# EAGLE design current sense (EAGLE 9.2.2)
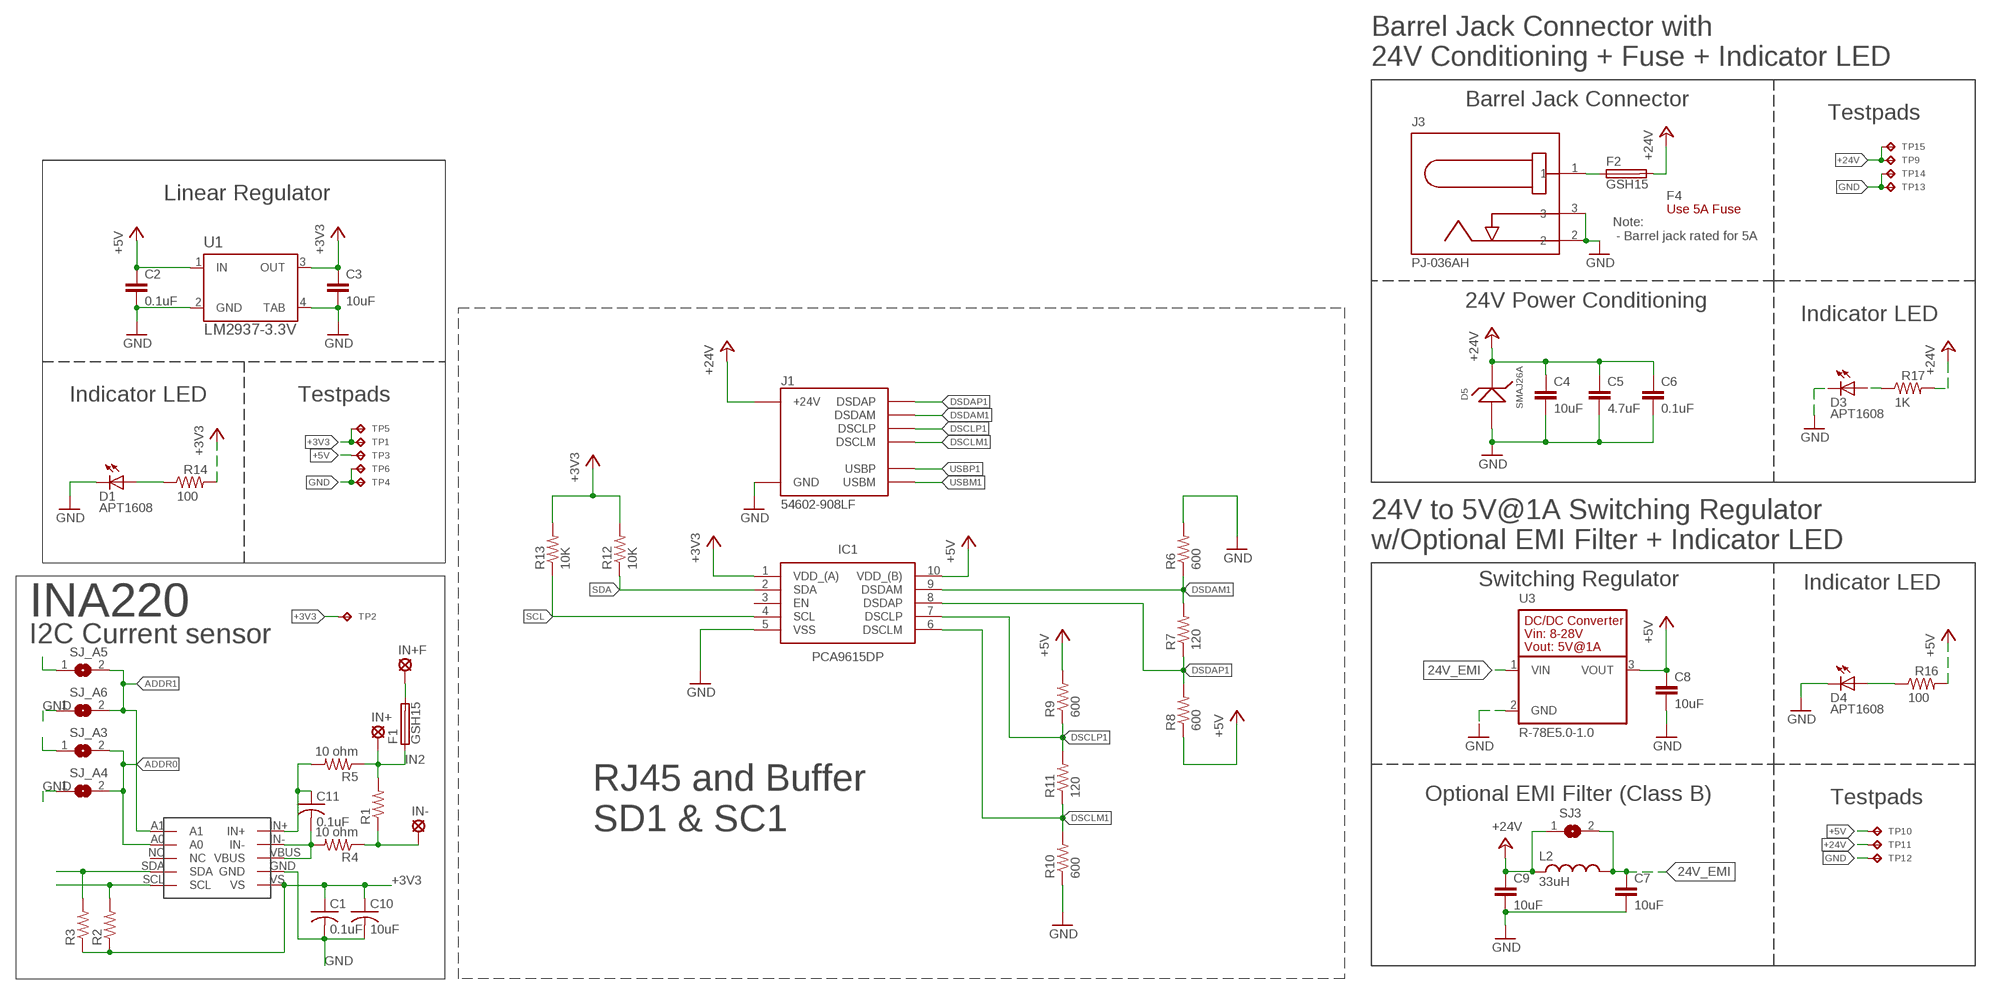
[diagram p0: schematic, sheet 1]

## Parts
C1  0.1uF  C-USC0603  [C0603]
C2  0.1uF  0.1UF-C0603C104K5RACTU  [C0603]
C3  10uF  10UF-GMK212BBJ106KG-T  [C0805]
C4  10uF  10UF-GMK212BBJ106KG-T  [C0805]
C5  4.7uF  4.7UF-CL21A475KBQNNNE  [C0805]
C6  0.1uF  0.1UF-C0603C104K5RACTU  [C0603]
C7  10uF  10UF-GMK212BBJ106KG-T  [C0805]
C8  10uF  10UF-GMK212BBJ106KG-T  [C0805]
C9  10uF  10UF-GMK212BBJ106KG-T  [C0805]
C10  10uF  C-USC0603  [C0603]
C11  0.1uF  C-USC0603  [C0603]
D1  APT1608  APT1608CGCK  [CHIPLED_0603]
D3  APT1608  APT1608CGCK  [CHIPLED_0603]
D4  APT1608  APT1608CGCK  [CHIPLED_0603]
D5  SMAJ26A  SMAJ26A-13-F  [SMA]
F1  GSH15  [GSH15]
F2  GSH15  [GSH15]
F4  Use 5A Fuse  0217005.MXP  [FUSE-CARTRIDGE]
IC1  PCA9615DP  [SOP50P490X110-10N]
IN+  LSP11  [LSP11]
IN+F  LSP11  [LSP11]
IN-  LSP11  [LSP11]
J1  54602-908LF  OPENAG-V1-RJ45PTH  [OPENAG-V1-RJ45]
J3  PJ-036AH  BARREL-JACK-PJ-036AH-SMT-TR  [BARREL-JACK-PJ-036AH]
L2  33uH  33UH-29333C  [29333C]
R1  R-US_R0805  [R0805]
R2  R-US_R0603  [R0603]
R3  R-US_R0603  [R0603]
R4  10 ohm  R-US_R0603  [R0603]
R5  10 ohm  R-US_R0603  [R0603]
R6  600  R-US_R0603  [R0603]
R7  120  R-US_R0603  [R0603]
R8  600  R-US_R0603  [R0603]
R9  600  R-US_R0603  [R0603]
R10  600  R-US_R0603  [R0603]
R11  120  R-US_R0603  [R0603]
R12  10K  R-US_R0603  [R0603]
R13  10K  R-US_R0603  [R0603]
R14  100  100OHM-RC0603JR-07100RL  [RC0603N]
R16  100  100OHM-RC0603JR-07100RL  [RC0603N]
R17  1K  1K-ERJ-PB3D1001V  [RC0603N]
SJ3  EMI-BYPASS  [EMI-BYPASS]
SJ_A3  SOLDERJUMPERREFLOW_NOPASTE  [SJ1]
SJ_A4  SOLDERJUMPERREFLOW_NOPASTE  [SJ1]
SJ_A5  SOLDERJUMPERREFLOW_NOPASTE  [SJ1]
SJ_A6  SOLDERJUMPERREFLOW_NOPASTE  [SJ1]
TP1  TPTP04R  [TP04R]
TP2  TPTP04R  [TP04R]
TP3  TPTP04R  [TP04R]
TP4  TPTP04R  [TP04R]
TP5  TPTP04R  [TP04R]
TP6  TPTP04R  [TP04R]
TP9  TPTP04R  [TP04R]
TP10  TPTP06R  [TP06R]
TP11  TPTP06R  [TP06R]
TP12  TPTP06R  [TP06R]
TP13  TPTP04R  [TP04R]
TP14  TPTP04R  [TP04R]
TP15  TPTP04R  [TP04R]
U1  LM2937-3.3V  LM2937IMP-3.3/NOPB  [MP04A]
U3  R-78E5.0-1.0  [R-78E5.0-1.0]
U$1  INA220  [VSSOP10]

## Nets
24V_EMI: C7.1 L2.2 SJ3.2 U3.1(VIN)
24V_IN1: F2.1 J3.1
+3V3: C1.1 C3.1 C10.1 IC1.1(VDD_(A)) R2.1 R3.1 R12.2 R13.2 R14.2 SJ_A3.1 SJ_A5.1 TP1.1(TP) TP2.1(TP) TP5.1(TP) U1.3(OUT) U$1.VS
+5V: C2.1 C8.1 IC1.10(VDD_(B)) R8.1 R9.2 R16.2 TP3.1(TP) TP10.TP U1.1(IN) U3.3(VOUT)
+24V: C4.1 C5.1 C6.1 C9.1 D5.1 F2.2 J1.24V(6)(+24V) L2.1 R17.2 SJ3.1 TP9.1(TP) TP11.TP TP15.1(TP)
ADDR0: SJ_A3.2 SJ_A4.2 U$1.A0
ADDR1: SJ_A5.2 SJ_A6.2 U$1.A1
DSCLM1: IC1.6(DSCLM) J1.DSCLM(5)(DSCLM) R10.2 R11.1
DSCLP1: IC1.7(DSCLP) J1.DSCLP(4)(DSCLP) R9.1 R11.2
DSDAM1: IC1.9(DSDAM) J1.DSDAM(2)(DSDAM) R6.1 R7.2
DSDAP1: IC1.8(DSDAP) J1.DSDAP(1)(DSDAP) R7.1 R8.2
GND: C1.2 C2.2 C3.2 C4.2 C5.2 C6.2 C7.2 C8.2 C9.2 C10.2 D1.C D3.C D4.C D5.2 IC1.5(VSS) J1.GND(3)(GND) J3.2 J3.3 R6.2 R10.1 SJ_A4.1 SJ_A6.1 TP4.1(TP) TP6.1(TP) TP12.TP TP13.1(TP) TP14.1(TP) U1.2(GND) U1.4(TAB) U3.2(GND) U$1.GND
IN2: F1.1 IN+.MP R1.2 R5.1
N$1: F1.2 IN+F.MP
N$2: C11.2 R4.2 U$1.IN- U$1.VBUS
N$3: C11.1 R5.2 U$1.IN+
N$4: IN-.MP R1.1 R4.1
N$6: D1.A R14.1
N$7: D3.A R17.1
N$9: D4.A R16.1
SCL: IC1.4(SCL) R2.2 R13.1 U$1.SCL
SDA: IC1.2(SDA) R3.2 R12.1 U$1.SDA
USBM1: J1.USBM(8)(USBM)
USBP1: J1.USBP(7)(USBP)
Unconnected: IC1.3(EN) U$1.NC

## Notes on the sheet
- Barrel Jack Connector with
  24V Conditioning + Fuse + Indicator LED
- Barrel Jack Connector
- Testpads
- Linear Regulator
- Note:
   - Barrel jack rated for 5A
- 24V Power Conditioning
- Indicator LED
- Indicator LED | Testpads
- 24V to 5V@1A Switching Regulator
  w/Optional EMI Filter + Indicator LED
- Switching Regulator | Indicator LED
- INA220
- I2C Current sensor
- Optional EMI Filter (Class B) | Testpads
- RJ45 and Buffer
  SD1 & SC1

## Library data of the parts
C1 C10 C11 = rcl:C-US: CAPACITOR, American symbol; SPICEPREFIX: C
C2 C6 = openag-capacitors:0.1UF-C0603C104K5RACTU: CAP CER 0.1UF 50V X7R 0603 Description: 0.1µF ±10% 50V Ceramic Capacitor X7R 0603 (1608 Metric) Technical Specifications: Capacitance: 0.1µF Tolerance: ±10% Rated Voltage: 50V Temperature Coefficient: X7R Operating Temperature: -55°C ~ 125°C Package / Case: 0603 (1608 Metric) Datasheet(s): X7R Dielectric, 6.3-250 VDC <https://search.kemet.com/component-edge/download/datasheet/C0603C104K5RACTU.pdf> Vendor(s): Digikey: 399-5089-1-ND <https://www.digikey.com/product-detail/en/kemet/C0603C104K5RACTU/399-5089-1-ND/1465623>; MANUFACTURER: Kemet; MPN: C0603C104K5RACTU; VENDOR: Digikey; VLINK: https://www.digikey.com/product-detail/en/kemet/C0603C104K5RACTU/399-5089-1-ND/1465623; VPN: 399-5089-1-ND
C3 C4 C7-C9 = openag-capacitors:10UF-GMK212BBJ106KG-T: CAP CER 10UF 35V X5R 0805 Description: 10µF ±10% 35V Ceramic Capacitor X5R 0805 (2012 Metric) Technical Specifications: Capacitance: 10µF Tolerance: ±10% Rated Voltage: 35V Temperature Coefficient: X5R Operating Temperature: -55°C ~ 85°C Package / Case: 0805 (2012 Metric) Datasheet(s): GMK212BBJ106KG-T Spec <http://ds.yuden.co.jp/TYCOMPAS/ut/detail.do?productNo=GMK212BBJ106KG-T&fileName=GMK212BBJ106KG-T_SS&mode=specSheetDownload> Vendor(s): Digikey: 587-4893-1-ND <https://www.digikey.com/product-detail/en/taiyo-yuden/GMK212BBJ106KG-T/587-4893-1-ND/6563736>; MANUFACTURER: Taiyo Yuden; MPN: GMK212BBJ106KG-T; VENDOR: Digikey; VLINK: https://www.digikey.com/product-detail/en/taiyo-yuden/GMK212BBJ106KG-T/587-4893-1-ND/6563736; VPN: 587-4893-1-ND
C5 = openag-capacitors:4.7UF-CL21A475KBQNNNE: CAP CER 4.7UF 50V X5R 0805 Description: 4.7µF ±10% 50V Ceramic Capacitor X5R 0805 (2012 Metric) Technical Specifications: Capacitance: 4.7uF Tolerance: ±10% Rated Voltage: 50V Temperature Coefficient: X5R Operating Temperature: -55°C ~ 85°C Package/Case: 0805 (2012 Metric) Datasheet(s): CL21A475KBQNNNE Characteristics <http://www.samsungsem.com/kr/front/downloadcms.do?path=/kr/support/product-search/mlcc/__icsFiles/afieldfile/2014/11/05&fileName=C_CL21A475KBQNNNE.pdf> Vendor(s): Digikey: 1276-1248-1-ND <https://www.digikey.com/product-detail/en/samsung-electro-mechanics/CL21A475KBQNNNE/1276-1248-1-ND/3889334>; MANUFACTURER: Samsung; MPN: CL21A475KBQNNNE; VENDOR: Digikey; VLINK: https://www.digikey.com/product-detail/en/samsung-electro-mechanics/CL21A475KBQNNNE/1276-1248-1-ND/3889334; VPN: 1276-1248-1-ND
D1 D3 D4 = openag-diodes:APT1608CGCK: LED GREEN CLEAR 0603 SMD Description: Green 570nm LED Indication - Discrete 2.1V 0603 (1608 Metric) Technical Specifications: Color: Green Lens Color: Colorless Lens Transparency: Clear Millicandela Rating: 50mcd Lens Style/Size: Rectangle with Flat Top, 1.20mm x 0.80mm Voltage - Forward (Vf) (Typ): 2.1V Current - Test: 20mA Viewing Angle: 120° Mounting Type: Surface Mount Wavelength - Dominant: 570nm Wavelength - Peak: 574nm Package / Case: 0603 (1608 Metric) Supplier Device Package: Chip LED Size / Dimension: 1.60mm L x 0.80mm W Height (Max): 0.75mm Datasheet(s): APT1608CGCK <http://www.kingbrightusa.com/images/catalog/SPEC/APT1608CGCK.pdf> Vendor(s): Digikey: 754-1116-1-ND <https://www.digikey.com/product-detail/en/kingbright/APT1608CGCK/754-1116-1-ND/1747833#>; MANUFACTURER: Kingbright; MPN: APT1608CGCK; VENDOR: Digikey; VLINK: https://www.digikey.com/product-detail/en/kingbright/APT1608CGCK/754-1116-1-ND/1747833#; VPN: 754-1116-1-ND
D5 = openag-diodes:SMAJ26A-13-F: TVS DIODE 26VWM 42.1VC SMA Description: TVS DIODE 26VWM 42.1VC SMA Technical Specifications: Type: Zener Voltage - Reverse Standoff (Typ): 26V Voltage - Breakdown (Min): 28.9V Voltage - Clamping (Max) @ Ipp: 42.1V Current - Peak Pulse (10/1000µs): 9.5A Power - Peak Pulse: 400W Power Line Protection: No Operating Temperature: -55°C ~ 150°C (TJ) DO-214AC, SMA Datasheet(s): SMAJ5.0(C)A - SMAJ200(C)A Vendor(s): Digikey: SMAJ26A-FDICT-ND <https://www.digikey.com/product-detail/en/diodes-incorporated/SMAJ26A-13-F/SMAJ26A-FDICT-ND/806583>; MANUFACTURER: Diodes Incorporated; MPN: SMAJ26A-13-F; VENDOR: Digikey; VLINK: https://www.digikey.com/product-detail/en/diodes-incorporated/SMAJ26A-13-F/SMAJ26A-FDICT-ND/806583; VPN: SMAJ26A-FDICT-ND
F1 F2 = openag-fuses:GSH15: FUSE BLOCK CART 250V 6.3A PCB Description: Fuse Block 6.3A 250V 1 Circuit Cartridge PCB Technical Specifications: Fuseholder Type: Block Fuse Type: Cartridge For Use With/Related Products: 5mm x 20mm Fuse Size: 5mm x 20mm Number of Circuits: 1 Voltage: 250V Current Rating: 6.3A Mounting Type: PCB Orientation: Horizontal Termination Style: PC Pin Contact Material: Copper Alloy Contact Finish: Tin Datasheet(s): 649 Series <http://www.littelfuse.com/~/media/electronics/datasheets/fuse_blocks/littelfuse_fuse_block_649_datasheet.pdf.pdf> Vendor(s): Digikey: WK0011-ND <https://www.digikey.com/product-detail/en/littelfuse-inc/64900001039/WK0011-ND/245470>; MANUFACTURER: Littelfuse Inc.; MPN: 64900001039; VENDOR: Digikey; VLINK: https://www.digikey.com/product-detail/en/littelfuse-inc/64900001039/WK0011-ND/245470; VPN: WK0011-ND
F4 = openag-fuses:0217005.MXP: FUSE GLASS 5A 250VAC 5X20MM Description: FUSE GLASS 5A 250VAC 5X20MM Technical Specifications: Fuse Type: Cartridge, Glass Current Rating: 5A Voltage Rating - AC: 250V Response Time: Fast Package / Case: 5mm x 20mm Mounting Type: Holder Breaking Capacity @ Rated Voltage: 50A Melting I²t: 42.795 Approvals: BSI, CE, CCC, CSA, KC, PSE, SEMKO, UR, VDE Operating Temperature: -55°C ~ 125°C Size / Dimension: 0.205" Dia x 0.787" L (5.20mm x 20.00mm) DC Cold Resistance: 0.0137 Ohms Datasheet(s): 217 Series Datasheet <http://www.littelfuse.com/~/media/electronics/datasheets/fuses/littelfuse_fuse_217_datasheet.pdf.pdf> Vendor(s): Digikey: F1725-ND <https://www.digikey.com/product-detail/en/littelfuse-inc/0217005.MXP/F1725-ND/777549#>; MANUFACTURER: Littelfuse Inc.; MPN: 0217005.MXP; VENDOR: Digikey; VLINK: https://www.digikey.com/product-detail/en/littelfuse-inc/0217005.MXP/F1725-ND/777549; VPN: F1725-ND
IC1 = PCA9615DP:PCA9615DP: Buffer, ReDriver 2 Channel 400kHz 10-TSSOP Source: Datasheet <http://www.nxp.com/docs/en/data-sheet/PCA9615.pdf>; DESCRIPTION: Buffer, ReDriver 2 Channel 400kHz 10-TSSOP; HEIGHT: 1.1mm; MANUFACTURER_NAME: Nexperia; MANUFACTURER_PART_NUMBER: PCA9615DP; SUPPLIER_NAME: RS
IN+ IN+F IN- = solpad:LSP11: SOLDER PAD drill 1.1 mm
J1 = openag_connector:OPENAG-V1-RJ45: Amphenol FCI - 54602-908LF - CONN MOD JACK 8P8C R/A UNSHLD Description: Jack Modular Connector 8p8c (RJ45, Ethernet) 90� Angle (Right) Unshielded Cat3 Technical Specifications: Connector Type: Jack Number of Positions/Contacts: 8p8c (RJ45, Ethernet) Number of Ports: 1 Number of Rows: 1 Mounting Type: Through Hole Orientation: 90� Angle (Right) Termination: Solder Shielding: Unshielded Ratings: Cat3 Features: Board Lock LED Color: Does Not Contain LED Tab Direction: Down Contact Material: Copper Alloy Contact Finish: Gold Contact Finish Thickness: 15�in (0.38�m) Housing Material: Polyester, Glass Filled Operating Temperature: -40�C ~ 70�C Datasheet(s): 54601-x04(zzz)WPLF Drawing <http://cdn.amphenol-icc.com/media/wysiwyg/files/drawing/c-bmj-0102.pdf> Vendor(s): Digikey: 609-1046-ND <https://www.digikey.com/product-detail/en/amphenol-fci/54602-908LF/609-1046-ND/1001360>; POPULATE: YES; VERIFIED: NO
J3 = openag-connectors:BARREL-JACK-PJ-036AH-SMT-TR: CONN PWR JACK 2X5.5MM SOLDER Description: Power Barrel Connector Jack 2.10mm ID (0.083"), 5.50mm OD (0.217") Surface Mount, Right Angle Technical Specifications: Connector Type: Jack Gender: Male Industry Recognized Mating Diameter: 2.10mm ID (0.083"), 5.50mm OD (0.217") Actual Diameter: 0.078" (2.00mm ID), 0.248" (6.30mm OD) Number of Positions/Contacts: 2 Conductors, 3 Contacts Internal Switch(s): Single Switch, Normally Closed Mounting Type: Surface Mount, Right Angle Termination: Solder Shielding: Unshielded Voltage - Rated: 24VDC Current Rating: 5A Mating Length/Depth: 0.360" (9.15mm) Contact Material - Plating: Silver Operating Temperature: -25°C ~ 85°C Housing Material: Polyamide (PA6T), Nylon 6T Contact Material: Brass; Copper Alloy Body Color: Black Datasheet(s): PJ-036AH-SMT-TR <http://www.cui.com/product/resource/digikeypdf/pj-036ah-smt-tr.pdf> Vendor(s): Digikey: CP-036AHPJCT-ND <https://www.digikey.com/product-detail/en/cui-inc/PJ-036AH-SMT-TR/CP-036AHPJCT-ND/1530994>; MANUFACTURER: CUI Inc.; MPN: PJ-036AH-SMT-TR; VENDOR: Digikey; VLINK: https://www.digikey.com/product-detail/en/cui-inc/PJ-036AH-SMT-TR/CP-036AHPJCT-ND/1530994; VPN: CP-036AHPJCT-ND
L2 = openag-inductors:33UH-29333C: FIXED IND 33UH 1A 120 MOHM SMD Description: 33µH Shielded Wirewound Inductor 1A 120 mOhm Max Nonstandard Technical Specifications: Type: Wirewound Inductance: 33µH Current Rating: 1A Shielding: Shielded DC Resistance (DCR): 120 mOhm Max Operating Temperature: -40°C ~ 85°C Frequency - Test: 10kHz Mounting Type: Surface Mount Package / Case: Nonstandard Size / Dimension: 0.283" L x 0.283" W (7.20mm x 7.20mm) Height - Seated (Max): 0.157" (4.00mm) Datasheet(s): 2900 Series <https://www.murata-ps.com/data/magnetics/kmp_2900.pdf> Vendor(s): Digikey: 811-1138-1-ND <https://www.digikey.com/product-detail/en/murata-power-solutions-inc/29333C/811-1138-1-ND/1924860>; MANUFACTURER: Murata Power Solutions Inc.; MPN: 29333C; VENDOR: Digikey; VLINK: https://www.digikey.com/product-detail/en/murata-power-solutions-inc/29333C/811-1138-1-ND/1924860; VPN: 811-1138-1-ND
R1-R5 = BeagleBone_Black_Wireless:R-US_: RESISTOR, American symbol
R6-R13 = rcl:R-US_: RESISTOR, American symbol
R14 R16 = openag-resistors:100OHM-RC0603JR-07100RL: RES SMD 100 OHM 5% 1/10W 0603 Description: 100 Ohms ±5% 0.1W, 1/10W Chip Resistor 0603 (1608 Metric) Moisture Resistant Thick Film Technical Specifications: Resistance: 100 Ohms Tolerance: ±5% Power (Watts): 0.1W, 1/10W Composition: Thick Film Features: Moisture Resistant Temperature Coefficient: ±100ppm/°C Operating Temperature: -55°C ~ 155°C Package / Case: 0603 (1608 Metric) Supplier Device Package: 0603 Size / Dimension: 0.063" L x 0.032" W (1.60mm x 0.80mm) Height - Seated (Max): 0.022" (0.55mm) Number of Terminations: 2 Datasheet(s): Thick Film Chip Resistor Intro <http://www.yageo.com.tw/exep/pages/download/literatures/PYu-R_INT-thick_7.pdf> Chip Resistor Marking <http://www.yageo.com/exep/pages/download/literatures/PYu-R_Marking_2.pdf> RC Series, L Datasheet <http://www.yageo.com/documents/recent/PYu-RC_Group_51_RoHS_L_8.pdf> Vendor(s): Digikey: 311-100GRCT-ND <https://www.digikey.com/product-detail/en/yageo/RC0603JR-07100RL/311-100GRCT-ND/729644>; MANUFACTURER: Yageo; MPN: RC0603JR-07100RL; VENDOR: Digikey; VLINK: https://www.digikey.com/product-detail/en/yageo/RC0603JR-07100RL/311-100GRCT-ND/729644; VPN: 311-100GRCT-ND
R17 = openag-resistors:1K-ERJ-PB3D1001V: RES SMD 1K OHM 0.5% 1/5W 0603 Description: 1 kOhms ±0.5% 0.2W, 1/5W Chip Resistor 0603 (1608 Metric) Automotive AEC-Q200, Pulse Withstanding Thick Film Technical Specifications: Resistance: 1 kOhms Tolerance: ±0.5% Power: 0.2W, 1/5W Operating Temperature: -55°C ~ 155°C Package / Case: 0603 (1608 Metric) Datasheet(s): ERJ-PB3, PB6 Series, High Precision Datasheet <https://industrial.panasonic.com/cdbs/www-data/pdf/RDM0000/AOA0000C328.pdf> Vendor(s): Digikey: P20283CT-ND <https://www.digikey.com/product-detail/en/panasonic-electronic-components/ERJ-PB3D1001V/P20283CT-ND/6214538>; MANUFACTURER: Panasonic; MPN: P20283CT-ND; VENDOR: Digikey; VLINK: https://www.digikey.com/product-detail/en/panasonic-electronic-components/ERJ-PB3D1001V/P20283CT-ND/6214538; VPN: P20283CT-ND
SJ3 = openag-connectors:EMI-BYPASS: EMI Bypass Solder Jumper; MPN: N/A
SJ_A3-SJ_A6 = openag-connectors:SOLDERJUMPER: SMD Solder JUMPER Solder the two pads together to create a connection, or remove the solder to break it. REFLOW - Use this footprint for solder paste and reflow ovens. WAVE - Use this footprint for hand-soldering (larger pads). CLOSED - Has a trace between the two pads to ensure it is closed by default. The trace needs to be cut to disable the jumper, and can be closed again by creating a solder bridge between the two pads.; MPN: N/A
TP1-TP6 TP9-TP15 = openag-testpads:TP: Test pad; MPN: N/A
U1 = openag-regulators:LM2937IMP-3.3/NOPB: IC REG LIN 3.3V 400MA SOT223-4 Description: Linear Voltage Regulator IC Positive Fixed 1 Output 3.3V 400mA SOT-223-4 Technical Specifications: Output Configuration: Positive Output Type: Fixed Number of Regulators: 1 Voltage - Input (Max): 26V Voltage - Output (Min/Fixed): 3.3V Voltage Dropout (Max): 1V @ 50mA Current - Output: 400mA Current - Quiescent (Iq): 2mA Current - Supply (Max): 1.25A Protection Features: Over Temperature, Reverse Polarity, Short Circuit Operating Temperature: -40°C ~ 85°C Mounting Type: Surface Mount Package / Case: TO-261-4, TO-261AA Supplier Device Package: SOT-223-4 Base Part Number: LM2937 Datasheet(s): LM2937-2.5, LM2937-3.3 Datasheet <http://www.ti.com/lit/ds/symlink/lm2937-2.5.pdf> Vendor(s): Digikey: LM2937IMP-3.3/NOPBCT-ND <https://www.digikey.com/product-detail/en/texas-instruments/LM2937IMP-3.3-NOPB/LM2937IMP-3.3-NOPBCT-ND/270742#>; MANUFACTURER: Texas Instruments; MPN: LM2937IMP-3.3/NOPB; VENDOR: Digikey; VLINK: https://www.digikey.com/product-detail/en/texas-instruments/LM2937IMP-3.3-NOPB/LM2937IMP-3.3-NOPBCT-ND/270742#; VPN: LM2937IMP-3.3/NOPBCT-ND
U3 = openag-regulators:R-78E5.0-1.0: DC/DC CONVERTER 5V 5W Description: Linear Regulator Replacement DC DC Converter 1 Output 5V 1A 8V - 28V Input Technical Specifications: Type: Linear Regulator Replacement Number of Outputs: 1 Voltage - Input (Min): 8V Voltage - Input (Max): 28V Voltage - Output 1: 5V Current - Output (Max): 1A Power (Watts): 5W Applications: ITE (Commercial) Features: SCP Operating Temperature: -40°C ~ 85°C Efficiency: 91% Mounting Type: Through Hole Package / Case: 3-SIP Module Size / Dimension: 0.46" L x 0.33" W x 0.41" H (11.6mm x 8.5mm x 10.4mm) Datasheet(s): R-78E-1.0 Series Datasheet <https://www.recom-power.com/pdf/Innoline/R-78Exx-1.0.pdf> Vendor(s): Digikey: 945-2201-ND <https://www.digikey.com/product-detail/en/recom-power/R-78E5.0-1.0/945-2201-ND/4930585>; MANUFACTURER: Recom Power; MPN: R-78E5.0-1.0; VENDOR: Digikey; VLINK: https://www.digikey.com/product-detail/en/recom-power/R-78E5.0-1.0/945-2201-ND/4930585; VPN: 945-2201-ND
U$1 = untitled:INA220

## Net classes
0 default: width 0.305 mm, drill 0.254 mm, clearance 0.254 mm

## Board
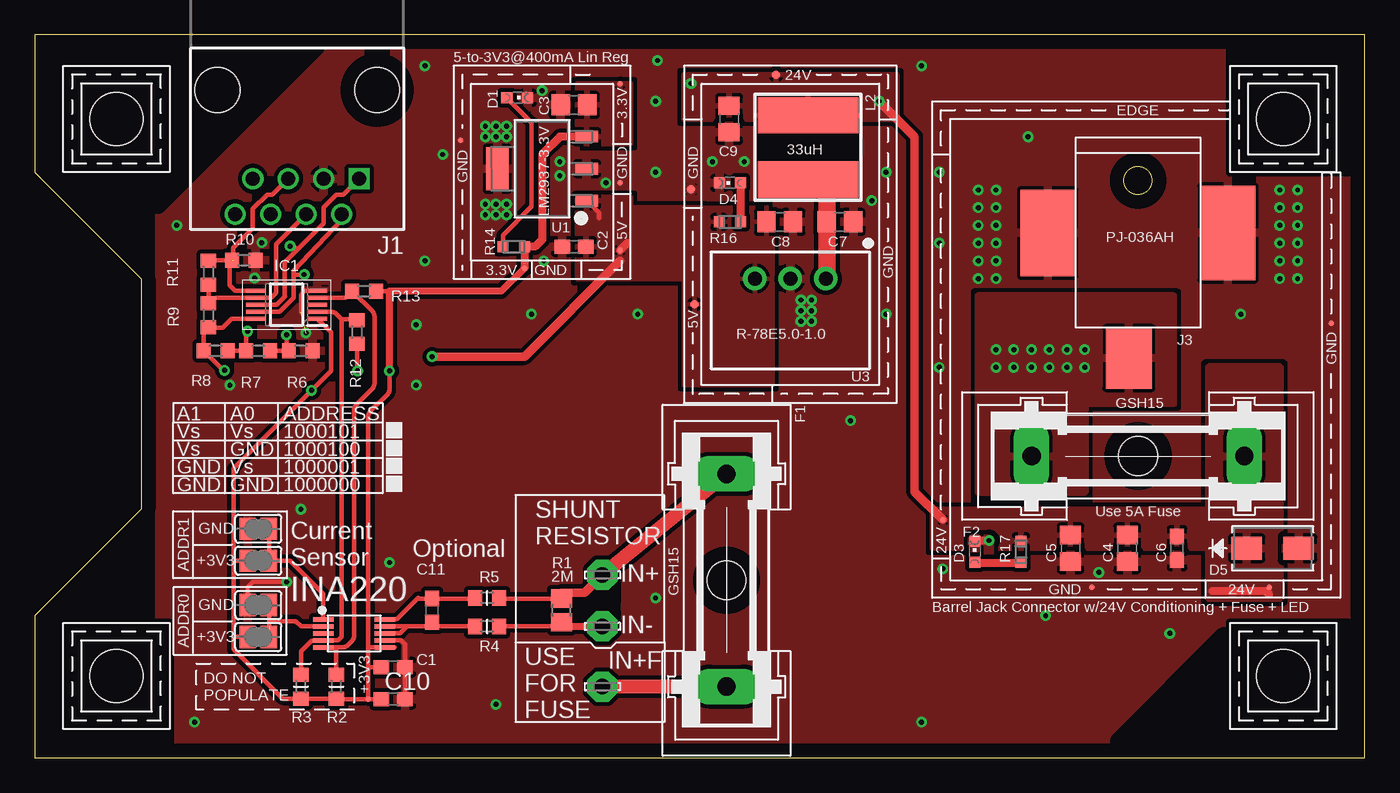
[diagram p1: board, top side]
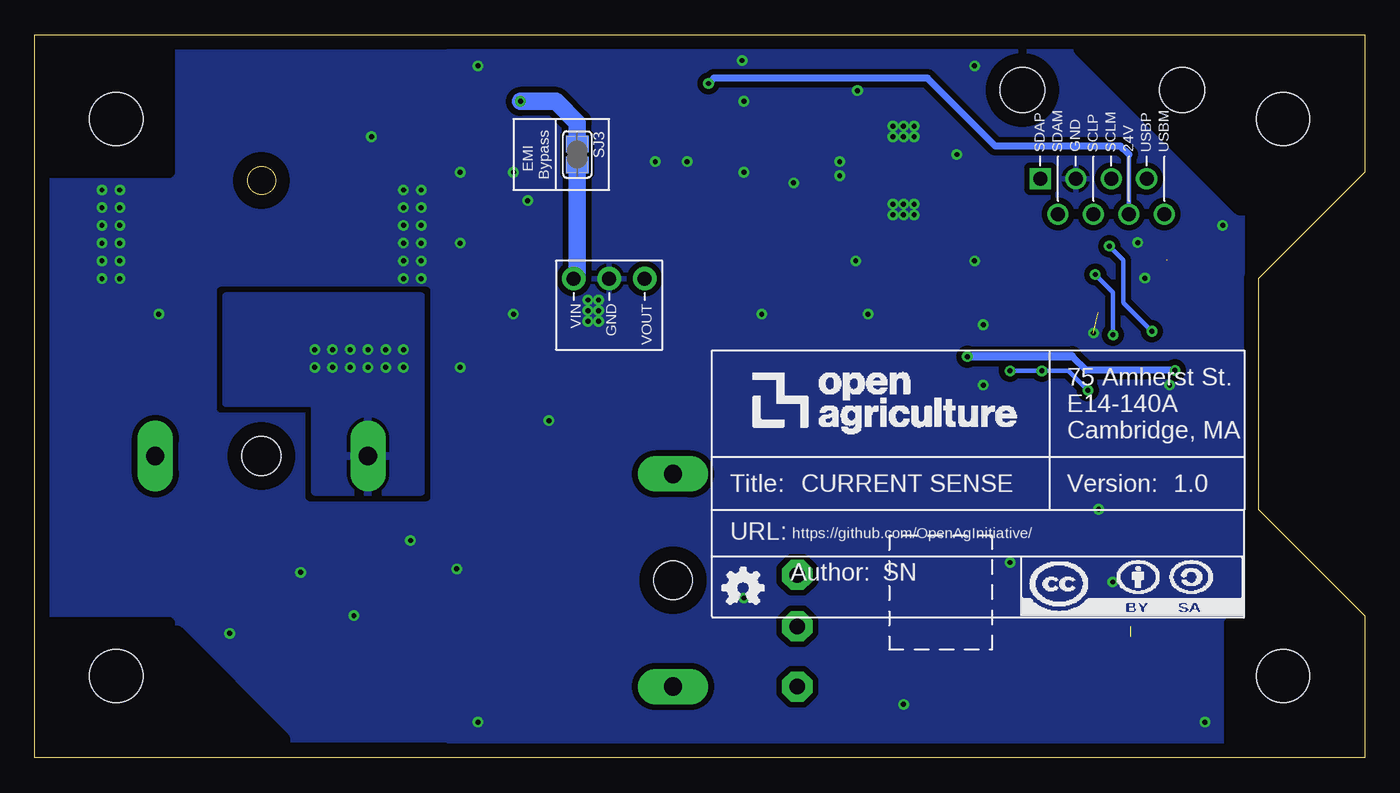
[diagram p2: board, bottom side, seen from below]

Size 95.23 x 51.74 mm. Coordinates in mm from the lower left corner, seen from the top.
Outline: 0,0 95.23,0 95.23,51.74 0,51.74 0,41.91 7.62,34.29 7.62,17.78 0,10.16 0,0
Copper layers (1*16): Top 0.035mm / dielectric 1.5mm / Bottom 0.035mm
Design rules "default": minimum track width 6mil, minimum drill 0.35mm, track to track 6mil, track to pad 6mil, pad to pad 6mil, via to via 6mil, smd to smd 6mil, copper to edge 40mil, drill to drill 6mil, minimum pad ring 10mil, minimum via ring 8mil, stop-mask expansion 4mil, vias tented up to drill 0mil, thermal gap 10mil
tRestrict: 6 lines
bRestrict: 2 lines

### Footprints (pad centres in the part's own frame; a part is rotated, then mirrored left to right if it is on the bottom)
C0603 = smd 1.1 x 1: 1 -0.85,0; 2 0.85,0
C0805 = smd 1.3 x 1.5: 1 -0.95,0; 2 0.95,0
CHIPLED_0603 = smd 0.8 x 0.8: A 0,-0.75; C 0,0.75
SMA = smd 2.18 x 1.63: 1 -1.857,0; 2 1.857,0
GSH15 = drill 1.321 pad 2.54 long: 1 -7.62,0; 2 7.62,0 | hole 2.794: 0,0
SOP50P490X110-10N = smd 1.4 x 0.3: 1 -2.2,1; 2 -2.2,0.5; 3 -2.2,0; 4 -2.2,-0.5; 5 -2.2,-1; 6 2.2,-1; 7 2.2,-0.5; 8 2.2,0; 9 2.2,0.5; 10 2.2,1
LSP11 = drill 1.118 pad 2.159 octagon: MP 0,0
OPENAG-V1-RJ45 = drill 1: 24V(6) 1.905,8.89; DSCLM(5) 0.635,6.35; DSCLP(4) -0.635,8.89; DSDAM(2) -3.175,8.89; GND(3) -1.905,6.35; USBM(8) 4.445,8.89; USBP(7) 3.175,6.35 | drill 1 square: DSDAP(1) -4.445,6.35 | hole 3.2: -5.715,0; 5.715,0
BARREL-JACK-PJ-036AH = smd 4.4 x 3.3: 1 2.2,-0.65 | smd 6.75 x 3.9: 2 -6.75,6.45 | smd 6.2 x 3.9: 3 -6.75,-6.45
29333C = smd 2.6 x 7.2: 1 -2.3,0; 2 2.3,0
R0805 = smd 1.3 x 1.5: 1 -0.85,0; 2 0.85,0
R0603 = smd 1 x 1.1: 1 -0.85,0; 2 0.85,0
RC0603N = smd 0.756 x 0.8: 1 -0.778,0; 2 0.778,0
EMI-BYPASS = smd 1.168 x 1.6: 1 -0.762,0.254; 2 0.762,0.254
SJ1 = smd 1.168 x 1.6: 1 -0.762,0; 2 0.762,0
TP04R = smd 0.4 x 0.4: 1 0,0
TP06R = smd 0.6 x 0.6: TP 0,0
MP04A = smd 1.6 x 0.838: 1 -3.2,2.3; 2 -3.2,0; 3 -3.2,-2.3 | smd 1.6 x 3.099: 4 3.2,0
R-78E5.0-1.0 = drill 1 pad 1.676: 1 -2.54,0; 2 0,0; 3 2.54,0
VSSOP10 = smd 1.45 x 0.3: A0 -2.2,0.5; A1 -2.2,1; GND 2.2,-0.5; IN+ 2.2,1; IN- 2.2,0.5; NC -2.2,0; SCL -2.2,-1; SDA -2.2,-0.5; VBUS 2.2,0; VS 2.2,-1
CORNER = hole 3.81: 0,0

### Placement (x,y rotation side)
ATTRIBUTES  [DOCFIELD]  46.72,10.05 0 bottom
C1  25.65,6.48 0 top
C2  38.61,36.58 180 top
C3  38.61,46.74 180 top
C4  78.23,14.99 270 top
C5  74.17,14.99 270 top
C6  81.79,14.99 270 top
C7  57.66,38.35 0 top
C8  53.34,38.35 0 top
C9  49.72,45.72 270 top
C10  25.65,4.19 0 top
C11  28.45,10.54 270 top
D1  34.54,47.24 270 top
D3  67.31,14.73 0 top
D4  49.78,41.15 90 top
D5  88.65,14.99 0 top
F1  49.53,12.7 270 top
F2  78.99,21.59 0 top
F4  75.95,17.27 0 top
IC1  18.02,32.43 180 top
IN+  40.64,13.08 0 top
IN+F  40.64,5.08 0 top
IN-  40.64,9.4 0 top
J1  18.79,47.8 180 top
J3  78.99,30.81 270 top
L2  55.37,43.69 270 top
R1  37.72,10.54 90 top
R2  21.59,5.08 90 top
R3  19.05,5.08 90 top
R4  32.38,9.4 180 top
R5  32.38,11.43 180 top
R6  19.04,29.13 0 top
R7  15.99,29.13 0 top
R8  12.94,29.13 0 top
R9  12.44,31.67 270 top
R10  14.98,35.6 180 top
R11  12.44,34.71 270 top
R12  23.07,30.47 270 top
R13  23.58,33.39 0 top
R14  34.29,36.58 0 top
R16  49.78,38.35 180 top
R17  70.61,14.73 90 top
SJ3  56.64,43.18 270 bottom
SJ_A3  16,8.64 0 top
SJ_A4  16,10.92 0 top
SJ_A5  16,14.1 0 top
SJ_A6  16,16.38 0 top
TP1  35.05,35.05 90 top
TP2  23.88,4.19 180 top
TP3  41.91,36.32 90 top
TP4  30.48,44.2 90 top
TP5  41.91,48.26 90 top
TP6  41.91,41.15 90 top
TP9  88.39,12.19 0 top
TP10  47.24,32.45 180 top
TP11  53.09,48.9 180 top
TP12  46.99,40.7 180 top
TP13  75.69,12.19 0 top
TP14  92.84,31.12 0 top
TP15  65.02,17.02 0 top
U1  36.32,42.16 180 top
U3  54.1,34.29 180 top
U$1  22.86,8.89 0 top
U$2  [CORNER]  89.41,45.72 180 top
U$3  [CORNER]  89.41,5.84 90 top
U$4  [CORNER]  5.84,45.72 270 top
U$5  [CORNER]  5.84,5.84 0 top

### Tracks (layer width: path | path; a pad name or v marks a point on that pad's centre or on a via)
24V_EMI
  Top 1.27: U3.1 56.71,34.36 C7.1 56.71,40.05 arc90 L2.2
  Bottom 1.27: SJ3.2 56.39,34.54 U3.1
24V_IN1  (via drill 0.35)
  other vias: 75.18,29.21 75.18,27.94 73.91,29.21 73.91,27.94 72.64,29.21 72.64,27.94 71.37,29.21 70.1,29.21 70.1,27.94 71.37,27.94 68.83,27.94 68.83,29.21
  pour Bottom (isolate 0.406): 75.18,19.05 67.56,19.05 67.56,33.02 81.53,33.02 81.53,25.4 75.18,25.4
  pour Top (isolate 0.406): 67.56,19.05 75.18,19.05 75.18,25.4 81.53,25.4 81.53,33.02 67.56,33.02
+3V3  (via drill 0.35)
  Top 0.305: 25.77,7.89 U$1.VS 23.99,7.89 23.88,8 | 14.22,8.64 14.22,7.75 17.74,4.23 R3.1 R2.1 21.63,4.19 TP2.1 | 14.22,8.64 14.22,14.1 SJ_A5.1 | 14.99,8.64 SJ_A3.1 14.22,8.64 | 24.68,6.6 C1.1 23.88,6.48 | 24.78,4.21 C10.1 TP2.1 | 14.22,13.97 14.22,20.7 v19.81,26.29 21.21,27.69 21.21,30.44 IC1.1 | R12.2 23.07,27.73 v23.11,27.69 | 25.4,33.39 R13.2 | 23.88,8 23.88,6.48 | 23.88,6.48 TP2.1 | v25.4,27.69 25.4,26.37 arc-45 25.25,26.01 24.02,24.79 arc45 23.88,24.43 23.88,8
  Top 0.508: TP1.1 33.39,33.39 25.4,33.39 v25.4,27.69
  Top 0.559: TP1.1 35.05,36.56 R14.2 35.81,36.58 36.32,37.08 36.32,43.18 37.61,44.46 U1.3
  Bottom 0.305: v25.4,27.69 v23.11,27.69 21.21,27.69 v19.81,26.29
  pour Top (isolate 0.305): 42.67,48.26 38.86,48.26 38.86,43.94 42.67,43.94
+5V  (via drill 0.35)
  Top 0.305: IC1.10 14.1,31.43 13.45,30.78 12.47,30.78 | 12.47,30.78 R9.2 | 12.47,30.78 12.09,30.4 R8.1 13.49,27.73 v13.58,27.73 | U1.1 40.39,39 40.39,38.61
  Top 0.559: 42.42,36.83 TP3.1
  Top 0.61: v28.45,28.7 35.05,28.7 41.91,35.56
  Bottom 0.508: 20.95,28.75 19.94,27.73 v13.58,27.73
  Bottom 0.61: v28.45,28.7 28.41,28.75 20.95,28.75
  pour Top (isolate 0.305): 42.67,34.29 42.67,40.13 38.86,40.13 38.86,34.29
  pour Top (isolate 0.406): 47.75,39.37 41.4,39.37 41.4,34.29 47.75,34.29
  pour Top (isolate 0.305): 46.48,26.67 46.48,39.37 52.83,39.37 52.83,26.67
  pour Top (isolate 0.406): 47.75,38.1 41.4,38.1 41.4,34.29 47.75,34.29
+24V  (via drill 0.35)
  Top 0.305: TP9.1 88.39,11.68
  Top 0.559: 84.33,11.94 88.14,11.94 88.39,11.68
  Top 0.61: TP15.1 62.99,19.05 62.99,44.45 v60.45,46.99
  Bottom 0.305: J1.24V(6) 16.88,43.18
  Bottom 0.508: 16.88,43.18 17.48,43.78 26.45,43.78 31.31,48.64 46.61,48.64 v46.99,48.26
  Bottom 1.27: SJ3.1 56.39,45.47 57.91,46.99 v60.45,46.99
  pour Top (isolate 0.406): 46.48,45.72 46.48,48.9 61.72,48.9 61.72,45.72
  pour Top (isolate 0.406): 89.15,11.43 89.15,27.94 84.07,27.94 84.07,11.43
  pour Top (isolate 0.406): 84.58,17.78 84.58,14.99 64.26,14.99 64.26,17.78
ADDR0  (1 unrouted)
  Top 0.305: SJ_A4.2 16.76,9.78 | 16.76,9.78 16.76,9.39 | U$1.A0 19.06,9.39 18.67,9.78 16.76,9.78
ADDR1
  Top 0.305: U$1.A1 20.66,11.73 18.29,14.1 SJ_A5.2 SJ_A6.2
DSCLM1  (1 unrouted)
  Top 0.305: R11.1 12.47,35.6 13.96,35.6 | 13.96,35.6 R10.2 | IC1.6 14.36,33.43 13.96,33.83 13.96,35.6 | 14.21,35.6 14.21,36.49 15.61,37.89 15.61,39.29 16.63,40.3 17.01,40.3 J1.DSCLM(5)
DSCLP1
  Top 0.305: R11.2 R9.1 12.98,32.94 13.45,32.94 13.59,32.93 IC1.7 16.93,32.93 17.27,33.27 17.26,33.28 17.26,36.75 J1.DSCLP(4)
DSDAM1  (via drill 0.35)
  Top 0.305: J1.DSDAM(2) 21.96,38.52 18.53,34.84 18.53,34.59 | IC1.9 15.83,31.92 17.52,31.92 18.53,32.94 18.53,34.59 | R7.2 R6.1 arc-90 18.02,29.29 v18.02,30.27 18.02,30.4 | v19.29,34.59 18.53,34.59
  Bottom 0.305: v19.29,34.59 18.02,33.32 v18.02,30.27
DSDAP1  (via drill 0.35)
  Top 0.305: R8.2 R7.1 15.14,30.44 v15.23,30.52 | 18.79,36.37 17.9,35.48 17.9,33.03 17.91,33.02 17.31,32.43 IC1.8 | 18.79,36.37 20.69,38.27 20.69,39.41 21.58,40.3 22.09,40.3 J1.DSDAP(1) | v18.28,36.62 18.53,36.62 18.79,36.37
  Bottom 0.305: v15.23,30.52 17.26,32.55 17.26,35.6 v18.28,36.62
GND  (via drill 0.35)  (1 unrouted)
  Top 0.305: U$1.GND 26.24,8.39 26.5,8.13 C1.2 C10.2 | v18.03,12.57 15.62,12.57 15.24,12.19 SJ_A4.1 | IC1.5 19.33,33.43 19.05,33.15 19.05,31.88
  Top 0.559: D3.C 67.37,15.55 v68.33,15.55
  other vias: 19.42,30.4 15.74,34.33 16.25,36.87 33.02,39.62 33.78,39.62 33.02,38.86 33.78,38.86 32.26,39.62 32.26,38.86 33.78,44.45 33.78,45.21 33.02,44.45 32.26,44.45 33.02,45.21 32.26,45.21 37.59,41.66 36.32,47.75 37.59,42.67 36.45,35.56 40.89,41.15 50.8,42.67 59.94,39.88 54.86,32.77 54.86,32 55.63,32 55.63,32.77 54.86,31.24 55.63,31.24 48.51,42.67 68.83,40.64 68.83,39.37 68.83,38.1 68.83,36.83 68.83,35.56 68.83,34.29 67.56,34.29 67.56,35.56 67.56,36.83 67.56,38.1 67.56,39.37 67.56,40.64 89.15,40.64 89.15,39.37 89.15,38.1 89.15,36.83 89.15,35.56 89.15,34.29 90.42,34.29 90.42,35.56 90.42,36.83 90.42,38.1 90.42,39.37 90.42,40.64 76.2,13.26 65.02,13.51 19.05,17.78 44.58,49.91 63.5,49.53 63.5,2.54 58.42,24.13 43.18,31.75 33.02,3.81 44.45,11.43 25.4,13.97 81.28,8.89 27.94,35.56 11.43,2.54 13.97,26.67 10.16,38.1 29.21,43.18 27.94,49.53 27.3,26.67 27.3,30.99 60.96,41.91 60.96,31.75 64.77,41.91 64.77,36.83 64.77,27.94 35.56,31.75 71.12,44.45 86.36,31.75 72.39,10.16 44.45,41.91 44.45,46.99
  pour Top (isolate 0.406, rank 3): 29.97,34.29 46.48,34.29 46.48,48.26 29.97,48.26
  pour Bottom (isolate 0.406): 8.76,1.02 8.76,51.31 65.53,51.31 65.53,1.02
  pour Top (isolate 0.305, rank 2): 46.48,25.4 46.48,49.53 64.26,49.53 64.26,25.4
  pour Bottom (isolate 0.406, rank 2): 64.26,25.4 64.26,49.53 46.48,49.53 46.48,25.4
  pour Top (isolate 0.305, rank 2): 8.89,0.76 8.89,51.31 94.36,51.31 94.36,0.76
  pour Bottom (isolate 0.406, rank 2): 62.99,50.8 94.11,50.8 94.11,1.27 62.99,1.27
IN2
  Top 0.305: R1.2 33.27,11.39 R5.1
  Top 0.508: 37.72,11.81 R1.2
  Top 0.61: IN+.MP 39.37,11.81 37.72,11.81
  Top 1.016: F1.1 IN+.MP
N$1
  Top 1.016: F1.2 IN+F.MP
N$2
  Top 0.305: U$1.IN- 26.67,9.39 | U$1.VBUS 26.17,8.89 26.67,9.39 | R4.2 28.74,9.4 C11.2 28.15,9.39 26.67,9.39
N$3
  Top 0.305: U$1.IN+ 25.89,9.89 27.43,11.43 27.47,11.39 C11.1 31.5,11.39 R5.2
N$4
  Top 0.305: 37.29,9.26 R1.1 37.43,9.4 R4.1
  Top 0.508: R1.1 38.01,9.4 IN-.MP
N$6
  Top 0.305: D1.A 35.59,45.45 35.59,39.46 33.51,37.39 R14.1
N$7
  Top 0.559: D3.A 67.34,13.95 R17.1
N$9
  Top 0.559: R16.1 50.56,41.12 D4.A
SCL
  Top 0.305: U$1.SCL 21.59,7.89 | IC1.4 22.27,32.93 R13.1 24.17,31.95 arc-45 24.32,31.59 24.32,26.79 arc-45 24.17,26.43 23.01,25.27 arc45 22.86,24.91 22.86,8.72 arc-45 22.71,8.36 22.41,8.07 22.39,8.04 arc-45 22.03,7.89 21.59,7.89 | 21.59,7.89 R2.2
SDA
  Top 0.305: R3.2 19.05,7.62 19.81,8.38 U$1.SDA 21.73,8.39 21.97,8.64 21.97,31.37 | R12.1 22.98,31.37 21.97,31.37 | 21.97,31.37 21.56,31.78 arc45 21.2,31.93 IC1.2

### Text on the board
tPlace: 5-to-3V3@400mA Lin Reg | 24V | 3.3V | EDGE | GND | GND | GND | 5V | 3.3V | GND | GND | 5V | GND | A1 | A0 | ADDRESS | Vs | Vs | 1000101 | Vs | GND | 1000100 | GND | Vs | 1000001 | GND | GND | 1000000 | 24V | GND | SHUNT / RESISTOR | Optional | ADDR1 | +3V3 | Current / Sensor | 2M | GND | 24V | INA220 | GND | Barrel Jack Connector w/24V Conditioning + Fuse + LED | +3V3 | ADDR0 | +3V3 | DO NOT / POPULATE | USE / FOR / FUSE